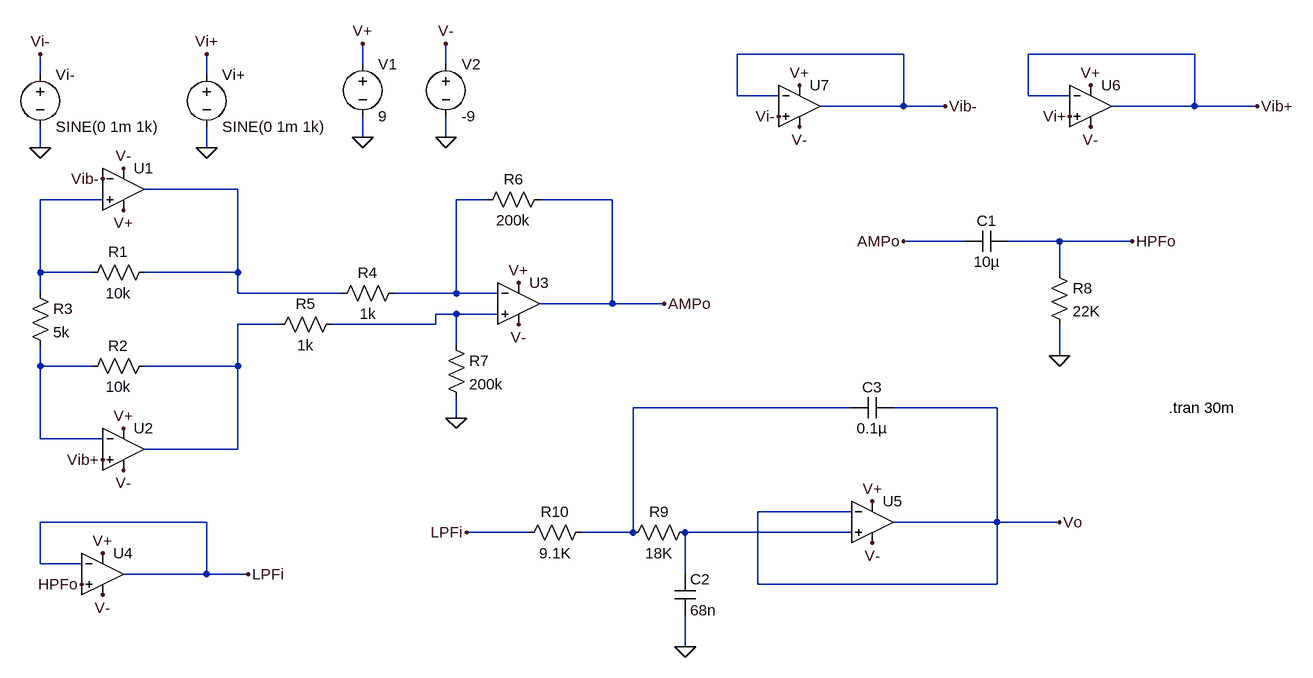
[diagram p0: schematic ECG.asc]
ECG.asc, the LTspice schematic file:
Version 4
SHEET 1 1808 680
WIRE -432 -848 -688 -848
WIRE 16 -848 -240 -848
WIRE -1264 -832 -1264 -864
WIRE -1136 -832 -1136 -864
WIRE -1760 -816 -1760 -848
WIRE -1504 -816 -1504 -848
WIRE -688 -784 -688 -848
WIRE -624 -784 -688 -784
WIRE -240 -784 -240 -848
WIRE -176 -784 -240 -784
WIRE -432 -768 -432 -848
WIRE -432 -768 -560 -768
WIRE -368 -768 -432 -768
WIRE 16 -768 16 -848
WIRE 16 -768 -112 -768
WIRE 112 -768 16 -768
WIRE -1264 -720 -1264 -752
WIRE -1136 -720 -1136 -752
WIRE -1760 -704 -1760 -736
WIRE -1504 -704 -1504 -736
WIRE -1456 -640 -1600 -640
WIRE -1664 -624 -1760 -624
WIRE -1072 -624 -1120 -624
WIRE -880 -624 -992 -624
WIRE -336 -560 -432 -560
WIRE -192 -560 -272 -560
WIRE -80 -560 -192 -560
WIRE -1760 -512 -1760 -624
WIRE -1680 -512 -1760 -512
WIRE -1456 -512 -1456 -640
WIRE -1456 -512 -1600 -512
WIRE -192 -512 -192 -560
WIRE -1760 -480 -1760 -512
WIRE -1456 -480 -1456 -512
WIRE -1296 -480 -1456 -480
WIRE -1120 -480 -1120 -624
WIRE -1120 -480 -1216 -480
WIRE -1056 -480 -1120 -480
WIRE -880 -464 -880 -624
WIRE -880 -464 -992 -464
WIRE -800 -464 -880 -464
WIRE -1120 -448 -1152 -448
WIRE -1056 -448 -1120 -448
WIRE -1392 -432 -1456 -432
WIRE -1152 -432 -1152 -448
WIRE -1152 -432 -1312 -432
WIRE -1120 -400 -1120 -448
WIRE -192 -384 -192 -432
WIRE -1760 -368 -1760 -400
WIRE -1680 -368 -1760 -368
WIRE -1456 -368 -1456 -432
WIRE -1456 -368 -1600 -368
WIRE -512 -304 -848 -304
WIRE -288 -304 -448 -304
WIRE -1120 -288 -1120 -320
WIRE -1760 -256 -1760 -368
WIRE -1664 -256 -1760 -256
WIRE -1456 -240 -1456 -368
WIRE -1456 -240 -1600 -240
WIRE -512 -144 -656 -144
WIRE -1504 -128 -1760 -128
WIRE -288 -128 -288 -304
WIRE -288 -128 -448 -128
WIRE -192 -128 -288 -128
WIRE -1008 -112 -1104 -112
WIRE -848 -112 -848 -304
WIRE -848 -112 -928 -112
WIRE -512 -112 -768 -112
WIRE -1760 -64 -1760 -128
WIRE -1696 -64 -1760 -64
WIRE -1504 -48 -1504 -128
WIRE -1504 -48 -1632 -48
WIRE -1440 -48 -1504 -48
WIRE -768 -48 -768 -112
WIRE -656 -32 -656 -144
WIRE -288 -32 -288 -128
WIRE -288 -32 -656 -32
WIRE -768 64 -768 16
FLAG -1504 -704 0
FLAG -1760 -704 0
FLAG -1264 -720 0
FLAG -1136 -720 0
FLAG -1264 -864 V+
FLAG -1136 -864 V-
FLAG -144 -800 V+
FLAG -144 -736 V-
FLAG -592 -800 V+
FLAG -592 -736 V-
FLAG -1760 -848 Vi-
FLAG -1504 -848 Vi+
FLAG -624 -752 Vi-
FLAG -176 -752 Vi+
FLAG -368 -768 Vib-
FLAG 112 -768 Vib+
FLAG -1120 -288 0
FLAG -1632 -208 V-
FLAG -1024 -496 V+
FLAG -1024 -432 V-
FLAG -1632 -272 V+
FLAG -800 -464 AMPo
FLAG -1632 -608 V+
FLAG -1632 -672 V-
FLAG -1664 -656 Vib-
FLAG -1664 -224 Vib+
FLAG -192 -384 0
FLAG -80 -560 HPFo
FLAG -432 -560 AMPo
FLAG -1664 -80 V+
FLAG -1664 -16 V-
FLAG -1696 -32 HPFo
FLAG -1440 -48 LPFi
FLAG -768 64 0
FLAG -480 -160 V+
FLAG -480 -96 V-
FLAG -192 -128 Vo
FLAG -1104 -112 LPFi
SYMBOL voltage -1760 -832 R0
WINDOW 123 0 0 Left 0
WINDOW 39 0 0 Left 0
SYMATTR InstName Vi-
SYMATTR Value SINE(0 1m 1k)
SYMBOL voltage -1504 -832 R0
WINDOW 123 0 0 Left 0
WINDOW 39 0 0 Left 0
SYMATTR InstName Vi+
SYMATTR Value SINE(0 1m 1k)
SYMBOL voltage -1264 -848 R0
SYMATTR InstName V1
SYMATTR Value 9
SYMBOL voltage -1136 -848 R0
SYMATTR InstName V2
SYMATTR Value -9
SYMBOL OpAmps\\UniversalOpAmp2 -144 -768 R0
SYMATTR InstName U6
SYMBOL OpAmps\\UniversalOpAmp2 -592 -768 R0
SYMATTR InstName U7
SYMBOL OpAmps\\UniversalOpAmp2 -1632 -640 R0
SYMATTR InstName U1
SYMBOL res -1584 -528 R90
WINDOW 0 0 56 VBottom 2
WINDOW 3 32 56 VTop 2
SYMATTR InstName R1
SYMATTR Value 10k
SYMBOL res -1584 -384 R90
WINDOW 0 0 56 VBottom 2
WINDOW 3 32 56 VTop 2
SYMATTR InstName R2
SYMATTR Value 10k
SYMBOL res -1776 -496 R0
SYMATTR InstName R3
SYMATTR Value 5k
SYMBOL OpAmps\\UniversalOpAmp2 -1632 -240 R0
SYMATTR InstName U2
SYMBOL res -1200 -496 R90
WINDOW 0 0 56 VBottom 2
WINDOW 3 32 56 VTop 2
SYMATTR InstName R4
SYMATTR Value 1k
SYMBOL res -1408 -416 R270
WINDOW 0 32 56 VTop 2
WINDOW 3 0 56 VBottom 2
SYMATTR InstName R5
SYMATTR Value 1k
SYMBOL OpAmps\\UniversalOpAmp2 -1024 -464 R0
SYMATTR InstName U3
SYMBOL res -976 -640 R90
WINDOW 0 0 56 VBottom 2
WINDOW 3 32 56 VTop 2
SYMATTR InstName R6
SYMATTR Value 200k
SYMBOL res -1136 -416 R0
SYMATTR InstName R7
SYMATTR Value 200k
SYMBOL cap -272 -576 R90
WINDOW 0 0 32 VBottom 2
WINDOW 3 32 32 VTop 2
SYMATTR InstName C1
SYMATTR Value 10µ
SYMBOL res -208 -528 R0
SYMATTR InstName R8
SYMATTR Value 22K
SYMBOL OpAmps\\UniversalOpAmp2 -1664 -48 R0
SYMATTR InstName U4
SYMBOL cap -784 -48 R0
SYMATTR InstName C2
SYMATTR Value 68n
SYMBOL res -752 -128 R90
WINDOW 0 0 56 VBottom 2
WINDOW 3 32 56 VTop 2
SYMATTR InstName R9
SYMATTR Value 18K
SYMBOL res -912 -128 R90
WINDOW 0 0 56 VBottom 2
WINDOW 3 32 56 VTop 2
SYMATTR InstName R10
SYMATTR Value 9.1K
SYMBOL cap -448 -320 R90
WINDOW 0 0 32 VBottom 2
WINDOW 3 32 32 VTop 2
SYMATTR InstName C3
SYMATTR Value 0.1µ
SYMBOL OpAmps\\UniversalOpAmp2 -480 -128 R0
SYMATTR InstName U5
TEXT -24 -304 Left 2 !.tran 30m

The netlist it stands for:
* ECG.asc
Vi- Vi- 0 SINE(0 1m 1k)
Vi+ Vi+ 0 SINE(0 1m 1k)
V1 V+ 0 9
V2 V- 0 -9
XU6 Vi+ Vib+ V+ V- Vib+ level2 Avol=1Meg GBW=10Meg Slew=10Meg Ilimit=25m Rail=0 Vos=0 En=0 Enk=0 In=0 Ink=0 Rin=500Meg  ; pins In+ In- V+ V- OUT
XU7 Vi- Vib- V+ V- Vib- level2 Avol=1Meg GBW=10Meg Slew=10Meg Ilimit=25m Rail=0 Vos=0 En=0 Enk=0 In=0 Ink=0 Rin=500Meg  ; pins In+ In- V+ V- OUT
XU1 N002 Vib- V- V+ N001 level2 Avol=1Meg GBW=10Meg Slew=10Meg Ilimit=25m Rail=0 Vos=0 En=0 Enk=0 In=0 Ink=0 Rin=500Meg  ; pins In+ In- V+ V- OUT
R1 N001 N002 10k
R2 N005 N006 10k
R3 N002 N006 5k
XU2 Vib+ N006 V+ V- N005 level2 Avol=1Meg GBW=10Meg Slew=10Meg Ilimit=25m Rail=0 Vos=0 En=0 Enk=0 In=0 Ink=0 Rin=500Meg  ; pins In+ In- V+ V- OUT
R4 N003 N001 1k
R5 N005 N004 1k
XU3 N004 N003 V+ V- AMPo level2 Avol=1Meg GBW=10Meg Slew=10Meg Ilimit=25m Rail=0 Vos=0 En=0 Enk=0 In=0 Ink=0 Rin=500Meg  ; pins In+ In- V+ V- OUT
R6 AMPo N003 200k
R7 N004 0 200k
C1 HPFo AMPo 10µ
R8 HPFo 0 22K
XU4 HPFo LPFi V+ V- LPFi level2 Avol=1Meg GBW=10Meg Slew=10Meg Ilimit=25m Rail=0 Vos=0 En=0 Enk=0 In=0 Ink=0 Rin=500Meg  ; pins In+ In- V+ V- OUT
C2 N008 0 68n
R9 N008 N007 18K
R10 N007 LPFi 9.1K
C3 Vo N007 0.1µ
XU5 N008 Vo V+ V- Vo level2 Avol=1Meg GBW=10Meg Slew=10Meg Ilimit=25m Rail=0 Vos=0 En=0 Enk=0 In=0 Ink=0 Rin=500Meg  ; pins In+ In- V+ V- OUT
.tran 30m
.lib UniversalOpAmp2.lib
.backanno
.end